# EAGLE design IR Receiver (EAGLE 5.04)
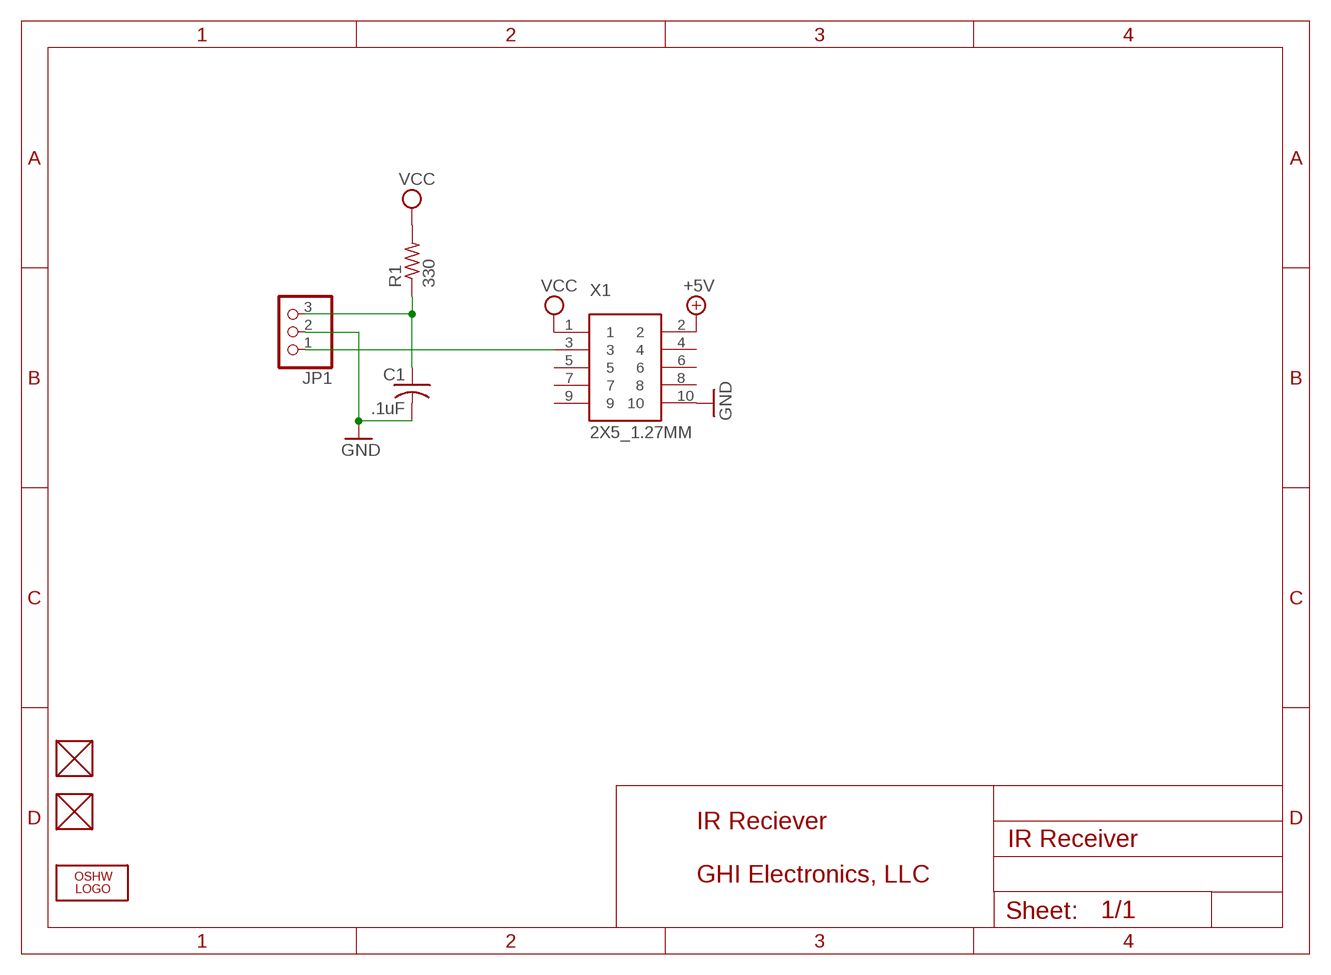
[diagram p0: schematic, sheet 1]

## Parts
C1  .1uF  C-USC0603K  [C0603K]
FUD1  FIDUCIAL  [FIDUCIAL_40MIL]
FUD2  FIDUCIAL  [FIDUCIAL_40MIL]
JP1  PINHD-1X3  [1X03]
LOGO1  LOGO-OSHW-FILLX0200-NT  [OSHW_FILLX200_NOTEXT]
R1  330  R-US_R0603  [R0603]
X1  2X5_1.27MM  [2X5_1.27MM]

## Nets
+5V [power]: X1.2
GND [power]: C1.2 JP1.2 X1.10
N$1: C1.1 JP1.3 R1.1
N$16: JP1.1 X1.3
VCC [power]: R1.2 X1.1
Unconnected: FUD1.P$1 FUD2.P$1 X1.4 X1.5 X1.6 X1.7 X1.8 X1.9

## Notes on the sheet
- IR Reciever
- GHI Electronics, LLC

## Library data of the parts
C1 = rcl:C-US: CAPACITOR, American symbol
FUD1 FUD2 = GHI:FIDUCIAL
JP1 = pinhead:PINHD-1X3: PIN HEADER
LOGO1 = Logo:LOGO-OSHW-FILL
R1 = rcl:R-US_: RESISTOR, American symbol
X1 = GHI:2X5_1.27MM

## Net classes
0 default: width 0.254 mm, drill 0.381 mm, clearance 0.203 mm

## Board
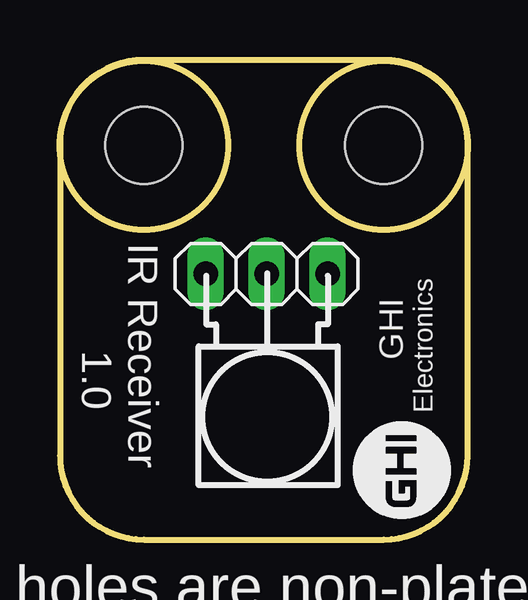
[diagram p1: board, top side]
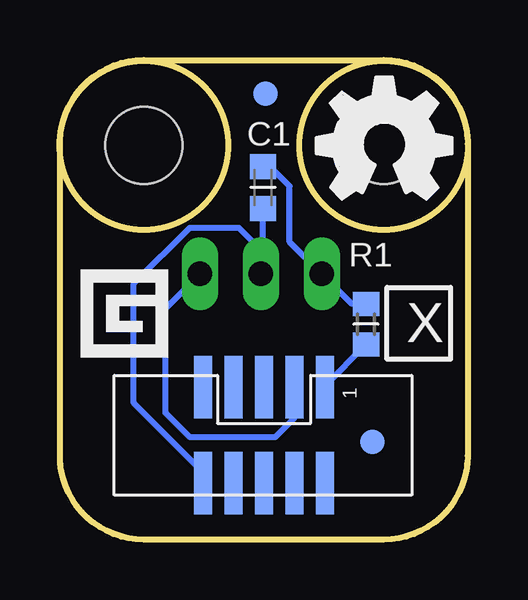
[diagram p2: board, bottom side, seen from below]

Size 17 x 20 mm. Coordinates in mm from the lower left corner, seen from the top.
Outline: 17,16.5 arc90 13.5,20 3.5,20 arc90 0,16.5 0,3.5 arc90 3.5,0 13.5,0 arc90 17,3.5 17,16.5
Outline: circle at 3.5,16.44 radius 3.5
Outline: circle at 13.5,16.44 radius 3.5
Copper layers (1+16): Top 0.035mm / dielectric 1.5mm / Bottom 0.035mm
Design rules "default *": minimum track width 8mil, minimum drill 12mil, track to track 8mil, track to pad 8mil, pad to pad 8mil, via to via 8mil, smd to smd 8mil, copper to edge 15mil, drill to drill 8mil, minimum pad ring 10mil, minimum via ring 7mil, stop-mask expansion 4mil, vias tented up to drill 50mil, thermal gap 10mil
Holes 3.2 mm at 13.5,16.44 3.5,16.44

### Footprints (pad centres in the part's own frame; a part is rotated, then mirrored left to right if it is on the bottom)
C0603K = smd 1.05 x 1.08: 1 -0.875,0; 2 0.875,0
FIDUCIAL_40MIL = smd 1.016 x 1.016: P$1 0,0
1X03 = drill 1.016 long: 1 -2.54,0; 2 0,0; 3 2.54,0
R0603 = smd 1 x 1.1: 1 -0.85,0; 2 0.85,0
2X5_1.27MM = smd 2.6 x 0.74: 1 -2,2.58; 2 2,2.58; 3 -2,1.31; 4 2,1.31; 5 -2,0.04; 6 2,0.04; 7 -2,-1.23; 8 2,-1.23; 9 -2,-2.5; 10 2,-2.5

### Placement (x,y rotation side)
C1  8.53,14.68 270 bottom
FUD1  8.43,18.59 0 bottom
FUD2  3.96,4.06 0 bottom
JP1  8.62,11.08 180 top
LOGO1  6.31,14.19 0 bottom
R1  4.23,8.98 270 bottom
X1  8.53,4.35 270 bottom

### Tracks (layer width: path | path; a pad name or v marks a point on that pad's centre or on a via)
GND
  Bottom 0.254: X1.10 11.03,2.8 13.92,5.69 13.92,10.67 11.58,13.01 9.55,13.01 8.53,11.99 8.53,11.17 JP1.2 8.53,11.17 C1.2
N$1
  Bottom 0.254: C1.1 8.24,15.55 7.42,14.73 7.42,12.42 JP1.3 4.83,9.83 R1.1
N$16
  Bottom 0.254: X1.3 7.22,5.07 8.03,4.27 11.58,4.27 12.6,5.28 12.6,9.64 JP1.1
VCC
  Bottom 0.254: X1.1 5.95,6.41 R1.2

### Text on the board
tPlace: IR Receiver | 1.0 | GHI | Electronics | corner holes are non-plated | Black PCB with white print | Do not add any manufacturing Code!
bPlace: X